# EAGLE design proyecto (EAGLE 9.6.2)
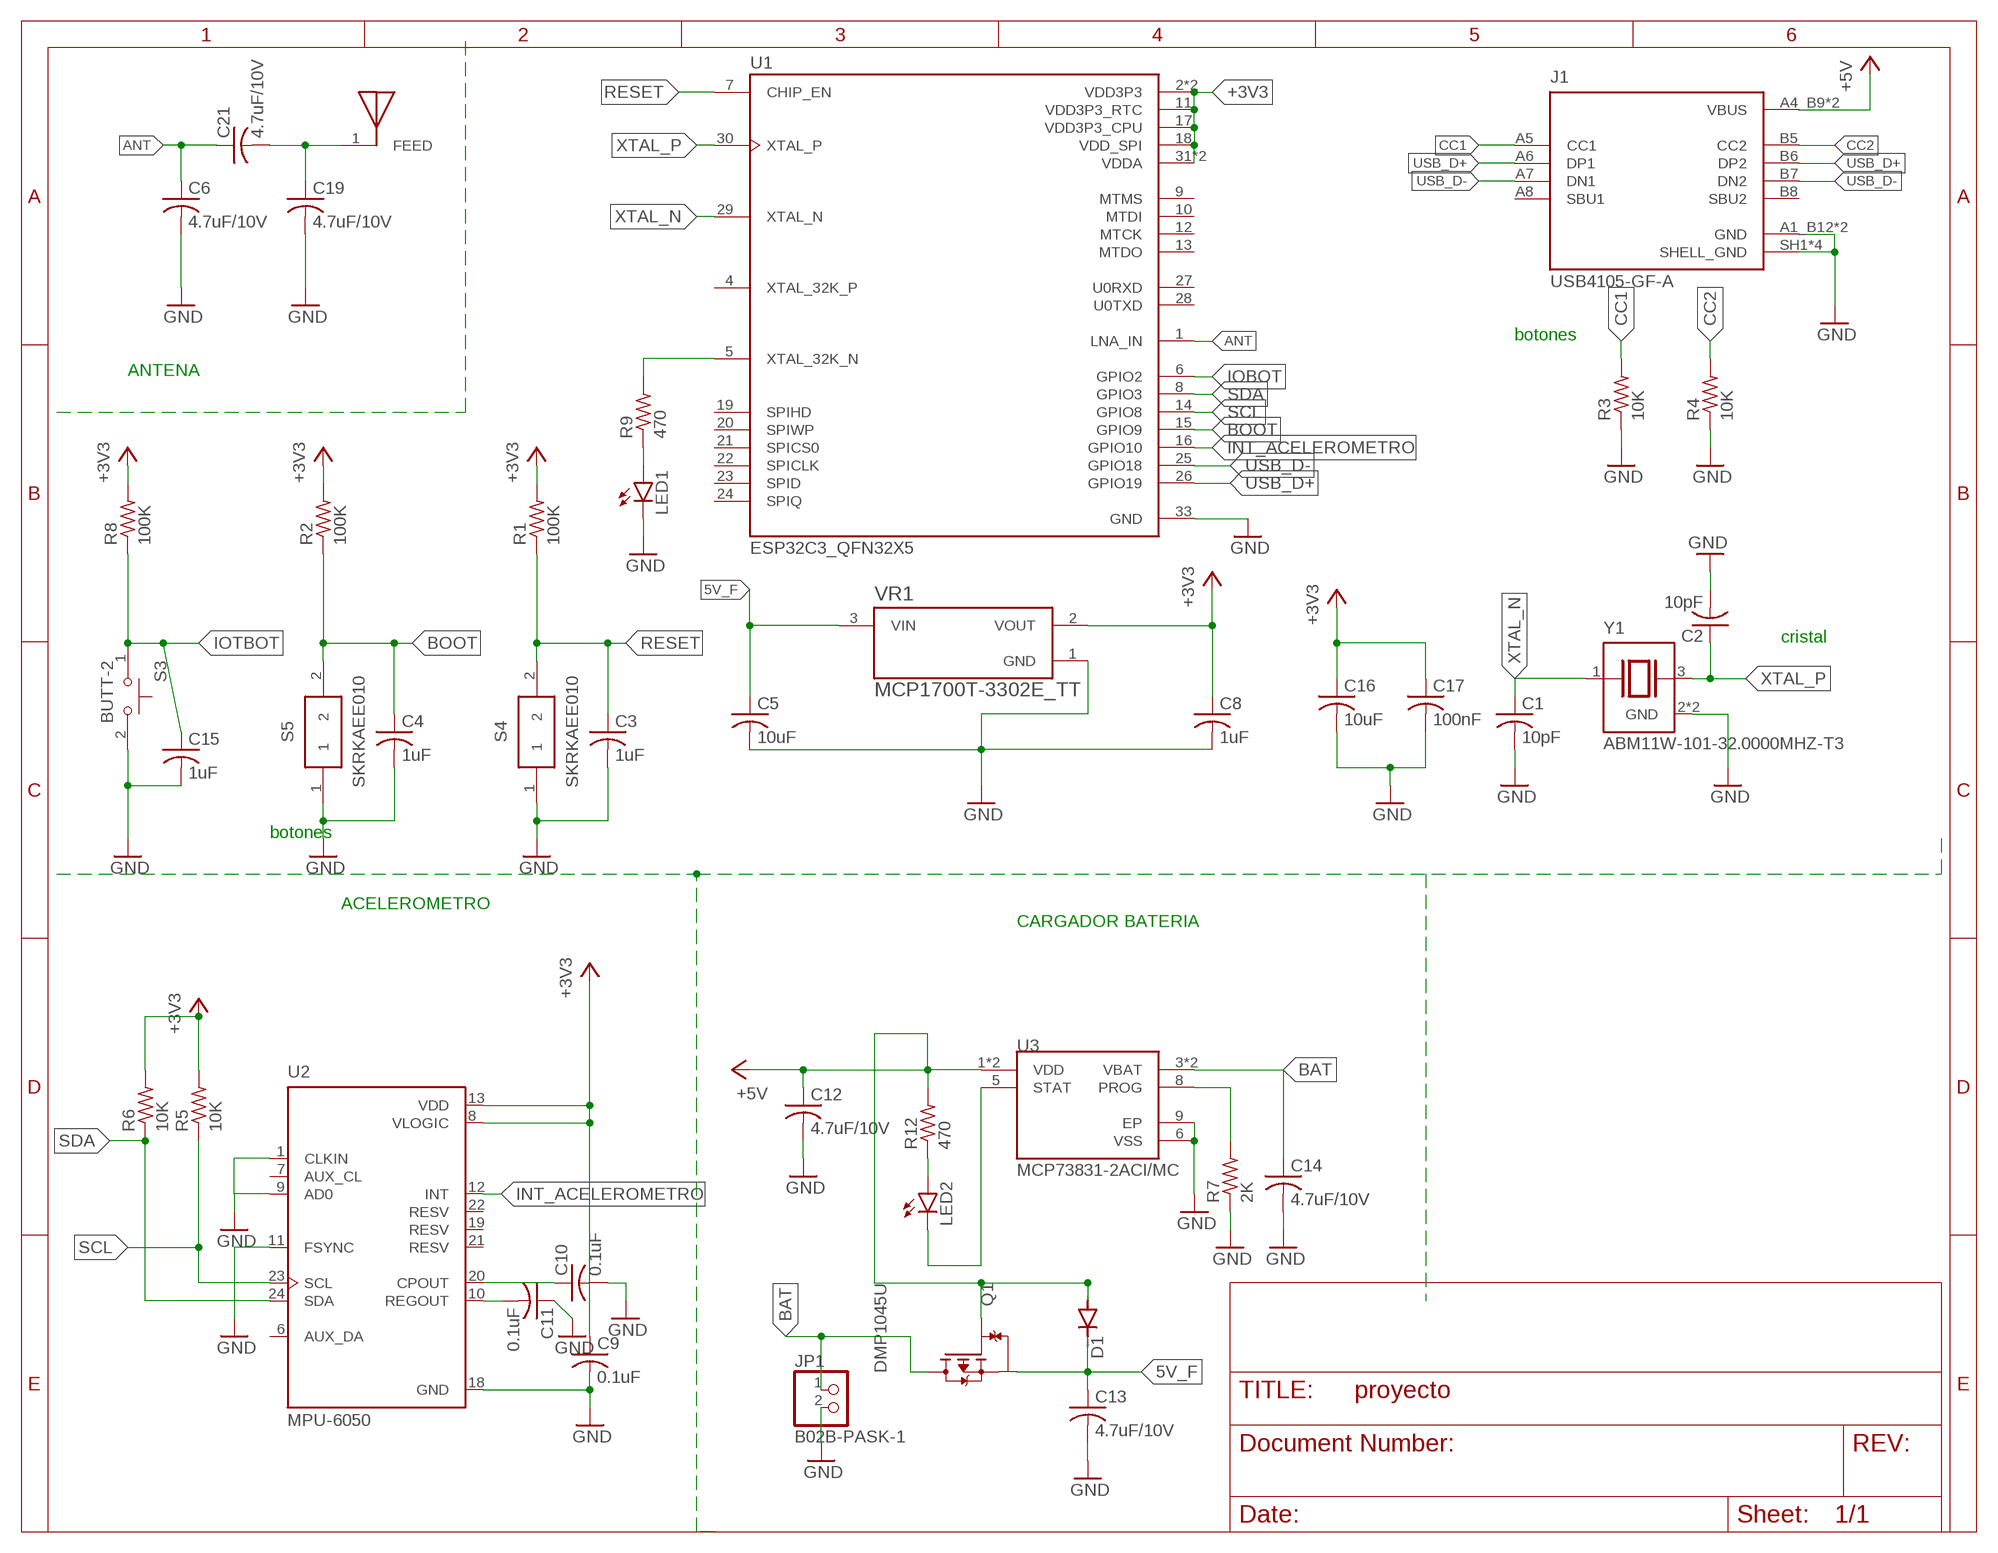
[diagram p0: schematic, sheet 1]

## Parts
C1  10pF  C-USC0603  [C0603]
C2  10pF  C-USC0603  [C0603]
C3  1uF  C-USC0603  [C0603]
C4  1uF  C-USC0603  [C0603]
C5  10uF  C-USC0603  [C0603]
C6  4.7uF/10V  C-USC0603  [C0603]
C8  1uF  C-USC0603  [C0603]
C9  0.1uF  C-USC0603  [C0603]
C10  0.1uF  C-USC0603  [C0603]
C11  0.1uF  C-USC0603  [C0603]
C12  4.7uF/10V  C-USC0603  [C0603]
C13  4.7uF/10V  C-USC0603  [C0603]
C14  4.7uF/10V  C-USC0603  [C0603]
C15  1uF  C-USC0603  [C0603]
C16  10uF  C-USC0603  [C0603]
C17  100nF  C-USC0603  [C0603]
C19  4.7uF/10V  C-USC0603  [C0603]
C21  4.7uF/10V  C-USC0603  [C0603]
D1  DIODE-DO214AA  [DO214AA]
J1  USB4105-GF-A  [GCT_USB4105-GF-A]
JP1  B02B-PASK-1  [B02B-PASK-1]
LED1  LEDSML0603  [SML0603]
LED2  LEDSML0603  [SML0603]
Q1  DMP1045U  [SOT91P240X110-3N]
R1  100K  R-US_R0603  [R0603]
R2  100K  R-US_R0603  [R0603]
R3  10K  R-US_R0603  [R0603]
R4  10K  R-US_R0603  [R0603]
R5  10K  R-US_R0603  [R0603]
R6  10K  R-US_R0603  [R0603]
R7  2K  R-US_R0603  [R0603]
R8  100K  R-US_R0603  [R0603]
R9  470  R-US_R0603  [R0603]
R12  470  R-US_R0603  [R0603]
S3  BUTT-2  [SW_BUTT-2]
S4  SKRKAEE010  [SKRK]
S5  SKRKAEE010  [SKRK]
U1  ESP32C3_QFN32X5  [QFN32_5X5MM]
U2  MPU-6050  [QFN50P400X400X95-24N]
U3  MCP73831-2ACI/MC  [SON50P200X300X100-9N]
U$1  RFANT5220110A0T  [ANTENA]
VR1  MCP1700T-3302E_TT  [SOT95P237X112-3N]
Y1  ABM11W-101-32.0000MHZ-T3  [XTAL_ABM11W-101-32.0000MHZ-T3]

## Nets
5V_F: C5.1 C13.1 D1.C Q1.2(S) VR1.3(VIN)
+3V3: C8.1 C9.1 C16.1 C17.1 R1.2 R2.2 R5.2 R6.2 R8.2 U1.2(VDD3P3) U1.3(VDD3P3) U1.11(VDD3P3_RTC) U1.17(VDD3P3_CPU) U1.18(VDD_SPI) U1.31(VDDA) U1.32(VDDA) U2.8(VLOGIC) U2.13(VDD) VR1.2(VOUT)
+5V: C12.1 D1.A J1.A4_B9(VBUS) J1.B4_A9(VBUS) Q1.1(G) R12.2 U3.1(VDD) U3.2(VDD)
+5V1: R9.2 U1.5(XTAL_32K_N)
ANT: C6.1 C21.1 U1.1(LNA_IN)
BAT: C14.1 JP1.1 Q1.3(D) U3.3(VBAT) U3.4(VBAT)
BOOT: C4.1 R2.1 S5.2 U1.15(GPIO9)
CC1: J1.A5(CC1) R3.2
CC2: J1.B5(CC2) R4.2
GND: C1.2 C2.2 C3.2 C4.2 C5.2 C6.2 C8.2 C9.2 C10.2 C11.1 C12.2 C13.2 C14.2 C15.2 C16.2 C17.2 C19.2 J1.A1_B12(GND) J1.B1_A12(GND) J1.SH1(SHELL_GND) J1.SH2(SHELL_GND) J1.SH3(SHELL_GND) J1.SH4(SHELL_GND) JP1.2 LED1.C R3.1 R4.1 R7.1 S3.2 S4.1 S5.1 U1.33(GND) U2.1(CLKIN) U2.9(AD0) U2.11(FSYNC) U2.18(GND) U3.6(VSS) U3.9(EP) VR1.1(GND) Y1.2(GND) Y1.4(GND)
INT_ACELEROMETRO: U1.16(GPIO10) U2.12(INT)
IOBOT: U1.6(GPIO2)
IOTBOT: C15.1 R8.1 S3.1
N$1: LED1.A R9.1
N$3: LED2.A R12.1
N$4: LED2.C U3.5(STAT)
N$5: R7.2 U3.8(PROG)
N$8: C11.2 U2.10(REGOUT)
N$10: C10.1 U2.20(CPOUT)
N$14: C19.1 C21.2 U$1.1(FEED)
RESET: C3.1 R1.1 S4.2 U1.7(CHIP_EN)
SCL: R5.1 U1.14(GPIO8) U2.23(SCL)
SDA: R6.1 U1.8(GPIO3) U2.24(SDA)
USB_D+: J1.A6(DP1) J1.B6(DP2) U1.26(GPIO19)
USB_D-: J1.A7(DN1) J1.B7(DN2) U1.25(GPIO18)
XTAL_N: C1.1 U1.29(XTAL_N) Y1.1
XTAL_P: C2.1 U1.30(XTAL_P) Y1.3
Unconnected: J1.A8(SBU1) J1.B8(SBU2) U1.4(XTAL_32K_P) U1.9(MTMS) U1.10(MTDI) U1.12(MTCK) U1.13(MTDO) U1.19(SPIHD) U1.20(SPIWP) U1.21(SPICS0) U1.22(SPICLK) U1.23(SPID) U1.24(SPIQ) U1.27(U0RXD) U1.28(U0TXD) U2.6(AUX_DA) U2.7(AUX_CL) U2.19(RESV) U2.21(RESV) U2.22(RESV)

## Notes on the sheet
- botones
- ANTENA
- cristal
- botones
- ACELEROMETRO
- CARGADOR BATERIA

## Library data of the parts
C1-C6 C8-C17 C19 C21 = rcl:C-US: CAPACITOR, American symbol; SPICEPREFIX: C
D1 = diode:DIODE-: DIODE
J1 = USB4105-GF-A:USB4105-GF-A: Check availability <https://pricing.snapeda.com/parts/USB4105-GF-A/GCT/view-part?ref=eda>; AVAILABILITY: In Stock; CHECK_PRICES: https://www.snapeda.com/parts/USB4105-GF-A/Global+Connector+Technology/view-part/?ref=eda; DESCRIPTION: USB-C (USB TYPE-C) USB 2.0 Receptacle Connector 24 (16+8 Dummy) Position Surface Mount, Right Angle; Through Hole; MF: GCT; MP: USB4105-GF-A; PACKAGE: None; PRICE: None; PURCHASE-URL: https://www.snapeda.com/api/url_track_click_mouser/?unipart_id=4423780&manufacturer=GCT&part_name=USB4105-GF-A&search_term=usb4105 gf a; SNAPEDA_LINK: https://www.snapeda.com/parts/USB4105-GF-A/Global+Connector+Technology/view-part/?ref=snap
JP1 = B02B-PASK-1:B02B-PASK-1: Connector JST PA series, 2 pin, 2mm pitch. Check availability <https://pricing.snapeda.com/parts/B02B-PASK-1/JST%20Sales/view-part?ref=eda>; AVAILABILITY: In Stock; CHECK_PRICES: https://www.snapeda.com/parts/B02B-PASK-1/JST+Sales+America+Inc./view-part/?ref=eda; DESCRIPTION: Connector Header Through Hole 2 position 0.079 (2.00mm); MF: JST Sales; MP: B02B-PASK-1; PACKAGE: None; PRICE: None; SNAPEDA_LINK: https://www.snapeda.com/parts/B02B-PASK-1/JST+Sales+America+Inc./view-part/?ref=snap
LED1 LED2 = led:LED: LED OSRAM: - CHIPLED LG R971, LG N971, LY N971, LG Q971, LY Q971, LO R971, LY R971 LH N974, LH R974 LS Q976, LO Q976, LY Q976 LO Q996 - Hyper CHIPLED LW Q18S LB Q993, LB Q99A, LB R99A - SideLED LS A670, LO A670, LY A670, LG A670, LP A670 LB A673, LV A673, LT A673, LW A673 LH A674 LY A675 LS A676, LA A676, LO A676, LY A676, LW A676 LS A679, LY A679, LG A679 - Hyper Micro SIDELED® LS Y876, LA Y876, LO Y876, LY Y876 LT Y87S - SmartLED LW L88C, LW L88S LB L89C, LB L89S, LG L890 LS L89K, LO L89K, LY L89K LS L896, LA L896, LO L896, LY L896 - TOPLED LS T670, LO T670, LY T670, LG T670, LP T670 LSG T670, LSP T670, LSY T670, LOP T670, LYG T670 LG T671, LOG T671, LSG T671 LB T673, LV T673, LT T673, LW T673 LH T674 LS T676, LA T676, LO T676, LY T676, LB T676, LH T676, LSB T676, LW T676 LB T67C, LV T67C, LT T67C, LS T67K, LO T67K, LY T67K, LW E67C LS E67B, LA E67B, LO E67B, LY E67B, LB E67C, LV E67C, LT E67C LW T67C LS T679, LY T679, LG T679 LS T770, LO T770, LY T770, LG T770, LP T770 LB T773, LV T773, LT T773, LW T773 LH T774 LS E675, LA E675, LY E675, LS T675 LS T776, LA T776, LO T776, LY T776, LB T776 LHGB T686 LT T68C, LB T68C - Hyper Mini TOPLED® LB M676 - Mini TOPLED Santana® LG M470 LS M47K, LO M47K, LY M47K Source: http://www.osram.convergy.de LUXEON: - LUMILED® LXK2-PW12-R00, LXK2-PW12-S00, LXK2-PW14-U00, LXK2-PW14-V00 LXK2-PM12-R00, LXK2-PM12-S00, LXK2-PM14-U00 LXK2-PE12-Q00, LXK2-PE12-R00, LXK2-PE12-S00, LXK2-PE14-T00, LXK2-PE14-U00 LXK2-PB12-K00, LXK2-PB12-L00, LXK2-PB12-M00, LXK2-PB14-N00, LXK2-PB14-P00, LXK2-PB14-Q00 LXK2-PR12-L00, LXK2-PR12-M00, LXK2-PR14-Q00, LXK2-PR14-R00 LXK2-PD12-Q00, LXK2-PD12-R00, LXK2-PD12-S00 LXK2-PH12-R00, LXK2-PH12-S00 LXK2-PL12-P00, LXK2-PL12-Q00, LXK2-PL12-R00 Source: www.luxeon.com KINGBRIGHT: KA-3528ASYC Source: www.kingbright.com
Q1 = DMP1045U:DMP1045U: P-Channel 12V 4A (Ta) 800mW (Ta) Surface Mount SOT-23 Check availability <https://pricing.snapeda.com/parts/DMP1045U/Diodes%20Inc./view-part?ref=eda>; AVAILABILITY: In Stock; CHECK_PRICES: https://www.snapeda.com/parts/DMP1045U/Diodes+Inc./view-part/?ref=eda; DESCRIPTION: P-Channel 12 V 2.6A (Ta) 530mW Surface Mount X2-WLB0808-4 (Type C); MF: Diodes Inc.; MP: DMP1045U; PACKAGE: SOT-23 Diodes Inc.; PRICE: None; SNAPEDA_LINK: https://www.snapeda.com/parts/DMP1045U/Diodes+Inc./view-part/?ref=snap
R1-R9 R12 = rcl:R-US_: RESISTOR, American symbol; SPICEPREFIX: R
S3 = BUTT-2:BUTT-2: Tactile Switches MINI PUSH BUTTON SWITCH 2-PIN QTY. 4 Check availability <https://pricing.snapeda.com/parts/BUTT-2/Gravitech/view-part?ref=eda>; AVAILABILITY: In Stock; CHECK_PRICES: https://www.snapeda.com/parts/BUTT-2/Gravitech/view-part/?ref=eda; DESCRIPTION: Tactile Switches MINI PUSH BUTTON SWITCH 2-PIN QTY. 4; MF: Gravitech; MP: BUTT-2; PACKAGE: None; PRICE: None; SNAPEDA_LINK: https://www.snapeda.com/parts/BUTT-2/Gravitech/view-part/?ref=snap
S4 S5 = SKRKAEE010:SKRKAEE010: Tactile Switches 3.9x2.9x2.0mm 160gf Packaging Temp 60oC <https://componentsearchengine.com/Images/1/SKRKAEE010.jpg> Source: Datasheet <http://www.mouser.com/ds/2/15/SKRK-1110686.pdf> Check availability <https://pricing.snapeda.com/parts/SKRKAEE010/ALPS/view-part?ref=eda>; AVAILABILITY: In Stock; CHECK_PRICES: https://www.snapeda.com/parts/SKRKAEE010/ALPS/view-part/?ref=eda; DESCRIPTION: Switch Tactile N.O. SPST Round Button Gull Wing 0.05A 12VDC 1.57N SMD T/R; MF: ALPS; MP: SKRKAEE010; PACKAGE: None; PRICE: None; SNAPEDA_LINK: https://www.snapeda.com/parts/SKRKAEE010/ALPS/view-part/?ref=snap
U1 = ESP32C3:ESP32C3: Check availability <https://pricing.snapeda.com/parts/ESP32-C3/Espressif%20Systems/view-part?ref=eda>; AVAILABILITY: In Stock; CHECK_PRICES: https://www.snapeda.com/parts/ESP32-C3/Espressif+Systems/view-part/?ref=eda; DESCRIPTION: WiFi Modules (802.11) (Engineering Samples Only) SMD IC ESP32-C3, RISC-V single-core MCU, 2.4G Wi-Fi & BLE 5.0 combo, QFN 32-pin, 5*5 mm, 40 ~ 105C; MF: Espressif Systems; MP: ESP32-C3; PACKAGE: VFQFN-32 Espressif Systems; PRICE: None; PURCHASE-URL: https://www.snapeda.com/api/url_track_click_mouser/?unipart_id=5833677&manufacturer=Espressif Systems&part_name=ESP32-C3&search_term=esp32 c3; SNAPEDA_LINK: https://www.snapeda.com/parts/ESP32-C3/Espressif+Systems/view-part/?ref=snap
U2 = MPU-6050:MPU-6050: MPU-6050 Six-Axis (Gyro + Accelerometer) MEMS MotionTracking™ Devices Check availability <https://pricing.snapeda.com/parts/MPU-6050/TDK%20InvenSense/view-part?ref=eda>; AVAILABILITY: In Stock; CHECK_PRICES: https://www.snapeda.com/parts/MPU-6050/TDK+InvenSense/view-part/?ref=eda; DESCRIPTION: MPU-6050 series Accelerometer, Gyroscope, 3 Axis Sensor Evaluation Board; MF: TDK InvenSense; MP: MPU-6050; PACKAGE: QFN-24 InvenSense; PRICE: None; PURCHASE-URL: https://www.snapeda.com/api/url_track_click_mouser/?unipart_id=43944&manufacturer=TDK InvenSense&part_name=MPU-6050&search_term=mpu6050; SNAPEDA_LINK: https://www.snapeda.com/parts/MPU-6050/TDK+InvenSense/view-part/?ref=snap
U3 = MCP73831-2ACI_MC:MCP73831-2ACI/MC: MCP73831 Series Single-Cell Li-Ion/Li-Polymer Battery Charge Controller - DFN-8 Check availability <https://pricing.snapeda.com/parts/MCP73831-2ACI/MC/Microchip/view-part?ref=eda>; AVAILABILITY: In Stock; CHECK_PRICES: https://www.snapeda.com/parts/MCP73831-2ACI/MC/Microchip/view-part/?ref=eda; DESCRIPTION: Charge Controller Li-Ion/Li-Pol 15mA to 500mA 4.2V 8-Pin DFN EP | Microchip Technology Inc. MCP73831-2ACI/MC; MF: Microchip; MP: MCP73831-2ACI/MC; PACKAGE: VFDFN-8 Microchip; PRICE: None; SNAPEDA_LINK: https://www.snapeda.com/parts/MCP73831-2ACI/MC/Microchip/view-part/?ref=snap
U$1 = untitled:RFANT5220110A0T
VR1 = MCP1700T-3302E_TT:MCP1700T-3302E_TT: Check availability <https://pricing.snapeda.com/parts/MCP1700T-3302E/TT/Microchip/view-part?ref=eda>; AVAILABILITY: In Stock; CHECK_PRICES: https://www.snapeda.com/parts/MCP1700T-3302E/TT/Microchip/view-part/?ref=eda; DESCRIPTION: Pwr Sply Func,Voltage Regulator,LDO,SOT-23,PD 369.6mW,VO 3.3V,Regline +/-0.75%/V | Microchip Technology Inc. MCP1700T-3302E/TT; MF: Microchip; MP: MCP1700T-3302E/TT; PACKAGE: SOT-23 Microchip; PRICE: None; PURCHASE-URL: https://www.snapeda.com/api/url_track_click_mouser/?unipart_id=8101&manufacturer=Microchip&part_name=MCP1700T-3302E/TT&search_term=mcp1700; SNAPEDA_LINK: https://www.snapeda.com/parts/MCP1700T-3302E/TT/Microchip/view-part/?ref=snap
Y1 = ABM11W-101-32.0000MHZ-T3:ABM11W-101-32.0000MHZ-T3: Check availability <https://pricing.snapeda.com/parts/ABM11W-101-32.0000MHZ-T3/Abracon%20LLC/view-part?ref=eda>; AVAILABILITY: In Stock; CHECK_PRICES: https://www.snapeda.com/parts/ABM11W-101-32.0000MHZ-T3/Abracon+LLC/view-part/?ref=eda; DESCRIPTION: IoT OPTIMIZED LOW PROFILE QUARTZ CRYSTAL; MF: Abracon LLC; MP: ABM11W-101-32.0000MHZ-T3; PACKAGE: SMD-4 Abracon LLC; PRICE: None; SNAPEDA_LINK: https://www.snapeda.com/parts/ABM11W-101-32.0000MHZ-T3/Abracon+LLC/view-part/?ref=snap

## Board
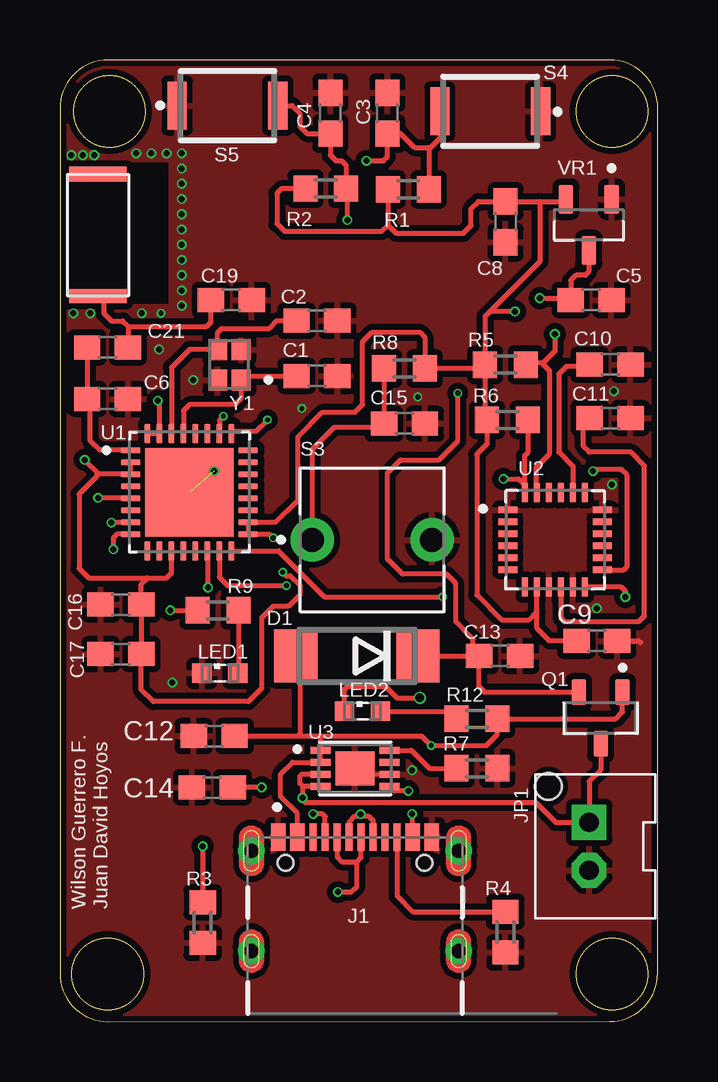
[diagram p1: board, top side]
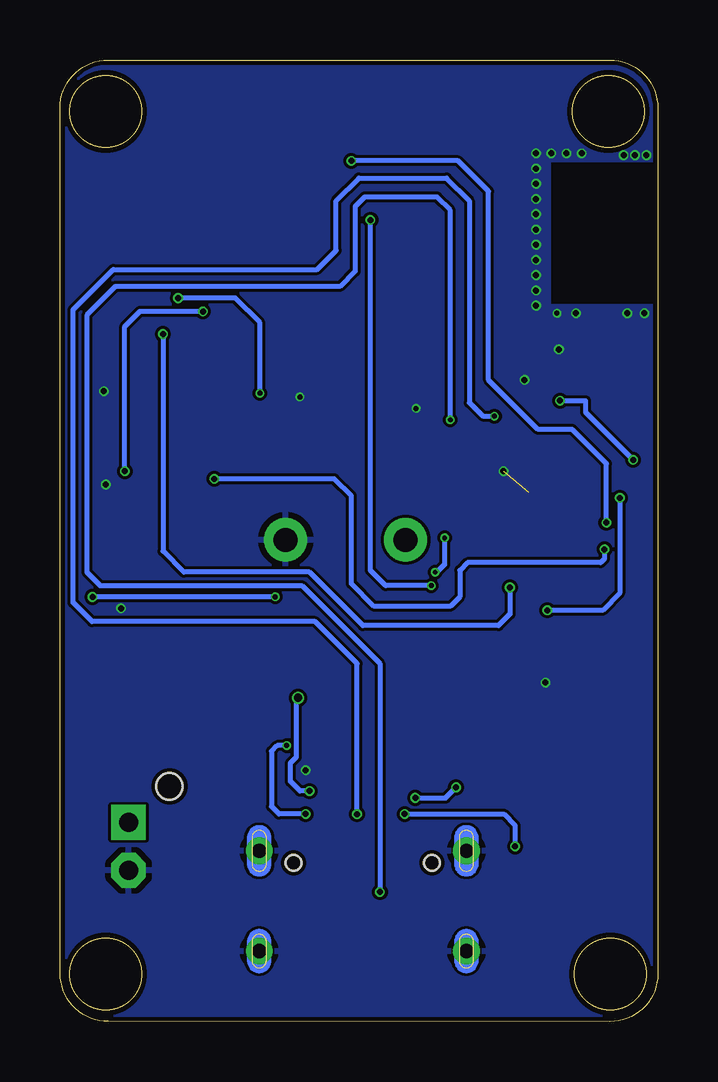
[diagram p2: board, bottom side, seen from below]

Size 24.93 x 40.09 mm. Coordinates in mm from the lower left corner, seen from the top.
Outline: 2,0 22.92,0.01 arc90 24.92,2.02 24.93,38.09 arc90 22.93,40.09 2,40.09 arc90 0,38.09 0,2 arc90 2,0
Outline: circle at 2.06,37.95 radius 1.5
Outline: circle at 23.02,1.99 radius 1.5
Outline: circle at 23.02,37.95 radius 1.5
Outline: circle at 1.98,1.99 radius 1.5
Copper layers (1*16): Top 0.035mm / dielectric 1.6mm / Bottom 0.035mm
Design rules "jlcpcb-2layers": minimum track width 5mil, minimum drill 0.3mm, track to track 5mil, track to pad 5mil, pad to pad 5mil, via to via 5mil, smd to smd 5mil, copper to edge 0.2mm, drill to drill 6mil, minimum pad ring 10mil, minimum via ring 3mil, stop-mask expansion 4mil, vias tented up to drill 0mil, thermal gap 10mil

### Footprints (pad centres in the part's own frame; a part is rotated, then mirrored left to right if it is on the bottom)
C0603 = smd 1.1 x 1: 1 -0.85,0; 2 0.85,0
DO214AA = smd 1.8 x 2.2: A 2.55,0; C -2.55,0
GCT_USB4105-GF-A = smd 0.6 x 1.15: A1_B12 -3.2,4.755; A4_B9 -2.4,4.755; B1_A12 3.2,4.755; B4_A9 2.4,4.755 | smd 0.3 x 1.15: A5 -1.25,4.755; A6 -0.25,4.755; A7 0.25,4.755; A8 1.25,4.755; B5 1.75,4.755; B6 0.75,4.755; B7 -0.75,4.755; B8 -1.75,4.755 | drill 0.6 pad 1: SH1 -4.32,4.18; SH2 4.32,4.18; SH3 -4.32,0; SH4 4.32,0 | hole 0.65: 2.89,3.68; -2.89,3.68
B02B-PASK-1 = drill 0.8 square: 1 -1,0 | drill 0.8 octagon: 2 1,0 | hole 1.1: -2.5,-1.7
SML0603 = smd 0.8 x 0.8: A 0.75,0; C -0.75,0
SOT91P240X110-3N = smd 1.09 x 0.61: 1 -1.07,0.915; 2 -1.07,-0.915; 3 1.07,0
R0603 = smd 1 x 1.1: 1 -0.85,0; 2 0.85,0
SW_BUTT-2 = drill 1: 1 -2.5,0; 2 2.5,0
SKRK = smd 0.8 x 2: 1 -2.1,0; 2 2.1,0
QFN32_5X5MM = smd 0.81 x 0.27: 1 -2.45,1.75; 2 -2.45,1.25; 3 -2.45,0.75; 4 -2.45,0.25; 5 -2.45,-0.25; 6 -2.45,-0.75; 7 -2.45,-1.25; 8 -2.45,-1.75; 17 2.45,-1.75; 18 2.45,-1.25; 19 2.45,-0.75; 20 2.45,-0.25; 21 2.45,0.25; 22 2.45,0.75; 23 2.45,1.25; 24 2.45,1.75 | smd 0.27 x 0.81: 9 -1.75,-2.45; 10 -1.25,-2.45; 11 -0.75,-2.45; 12 -0.25,-2.45; 13 0.25,-2.45; 14 0.75,-2.45; 15 1.25,-2.45; 16 1.75,-2.45; 25 1.75,2.45; 26 1.25,2.45; 27 0.75,2.45; 28 0.25,2.45; 29 -0.25,2.45; 30 -0.75,2.45; 31 -1.25,2.45; 32 -1.75,2.45 | smd 3.7 x 3.7: 33 0,0
QFN50P400X400X95-24N = smd 0.79 x 0.26: 1 -1.97,1.25; 2 -1.97,0.75; 3 -1.97,0.25; 4 -1.97,-0.25; 5 -1.97,-0.75; 6 -1.97,-1.25; 13 1.97,-1.25; 14 1.97,-0.75; 15 1.97,-0.25; 16 1.97,0.25; 17 1.97,0.75; 18 1.97,1.25 | smd 0.26 x 0.79: 7 -1.25,-1.97; 8 -0.75,-1.97; 9 -0.25,-1.97; 10 0.25,-1.97; 11 0.75,-1.97; 12 1.25,-1.97; 19 1.25,1.97; 20 0.75,1.97; 21 0.25,1.97; 22 -0.25,1.97; 23 -0.75,1.97; 24 -1.25,1.97
SON50P200X300X100-9N = smd 0.84 x 0.27: 1 -1.435,0.75; 2 -1.435,0.25; 3 -1.435,-0.25; 4 -1.435,-0.75; 5 1.435,-0.75; 6 1.435,-0.25; 7 1.435,0.25; 8 1.435,0.75 | smd 1.625 x 1.425: 9 0,0
ANTENA = smd 2.4 x 0.6: 1 0,0 | smd 2.4 x 0.635: 2 0,5.08
SOT95P237X112-3N = smd 1.22 x 0.62: 1 -1.065,0.95; 2 -1.065,-0.95; 3 1.065,0
XTAL_ABM11W-101-32.0000MHZ-T3 = smd 0.775 x 0.875: 1 -0.487,0.637; 2 -0.487,-0.637; 3 0.487,-0.637; 4 0.487,0.637

### Placement (x,y rotation side)
C1  10.72,26.91 0 top
C2  10.72,29.22 0 top
C3  13.65,37.87 90 top
C4  11.27,37.87 90 top
C5  22.15,30.09 0 top
C6  1.98,25.96 0 top
C8  18.57,33.34 270 top
C9  22.38,15.88 0 top
C10  22.94,27.39 0 top
C11  22.94,25.17 180 top
C12  6.43,11.91 180 top
C13  18.34,15.25 0 top
C14  6.35,9.77 180 top
C15  14.37,24.93 0 top
C16  2.54,17.39 180 top
C17  2.54,15.33 180 top
C19  7.14,30.09 0 top
C21  1.98,28.11 0 top
D1  12.38,15.25 180 top
J1  12.3,2.94 0 top
JP1  22.07,7.31 270 top
LED1  6.67,14.53 0 top
LED2  12.62,12.94 0 top
Q1  22.54,12.66 270 top
R1  14.53,34.69 180 top
R2  11.08,34.72 180 top
R3  5.95,4.13 90 top
R4  18.57,3.74 90 top
R5  18.57,27.39 180 top
R6  18.65,25.09 180 top
R7  17.38,10.56 180 top
R8  14.37,27.23 0 top
R9  6.59,17.15 180 top
R12  17.38,12.63 0 top
S3  13.02,20.09 0 top
S4  17.94,37.95 180 top
S5  6.99,38.19 0 top
U1  5.4,22.07 0 top
U2  20.64,20.09 0 top
U3  12.3,10.56 0 top
U$1  1.59,30.25 0 top
VR1  22.05,33.22 270 top
Y1  7.06,27.39 180 top

### Tracks (layer width: path | path; a pad name or v marks a point on that pad's centre or on a via)
5V_F  (via drill 0.2, 0.25)
  Top 0.203: VR1.3 22.05,31.26 21.91,31.12 21.51,31.12 21.3,30.91 21.3,30.17 | 21.3,30.17 C5.1 | D1.C C13.1 | Q1.2 17.71,13.73 17.46,13.98 17.46,15.22 C13.1 | C13.1 17.22,15.51 17.22,15.96 16.51,16.68 16.51,18.26 16.11,18.66 14.29,18.66 13.65,19.29 13.65,22.87 14.21,23.42 15.8,23.42 16.59,24.22 v16.59,26.2 | v20,30.17 21.29,30.17 21.3,30.17
  Bottom 0.203: v16.59,26.2 16.59,29.14 17.62,30.17 v20,30.17
+3V3  (via drill 0.2, 0.25)
  Top 0.203: 20,34.19 C8.1 17.44,34.19 17.14,33.9 17.14,33.19 16.83,32.87 14.02,32.87 13.68,33.21 | 20,34.19 21.01,34.19 VR1.2 | R5.2 17.57,27.23 R8.2 15.22,28.53 15,28.74 13.02,28.74 12.62,28.34 12.62,25.72 12.3,25.41 10.95,25.41 9.92,24.37 9.92,21.76 8.99,20.82 U1.18 U1.17 8.73,20.32 v8.89,20.17 | R5.2 17.72,25.17 R6.2 17.8,24.08 17.38,23.66 17.38,17.79 18.41,16.75 19.57,16.75 19.89,17.07 | U1.32 4.13,24.52 | 4.13,24.52 U1.31 | U1.3 U1.2 | U1.3 2.91,22.79 | U1.3 1.63,22.82 | 1.63,22.82 1.55,22.82 1.55,22.75 0.79,21.99 0.79,18.9 1.19,18.5 3.65,18.5 | v1.03,23.42 1.63,22.82 | v4.08,25.88 4.13,25.84 4.13,24.52 | 3.65,18.5 3.39,18.24 C16.1 C17.1 3.39,13.84 3.89,13.34 7.86,13.34 8.41,13.9 8.41,16.83 8.89,17.31 9.53,17.31 10,17.79 10,18.2 9.61,18.59 9.44,18.59 v9.29,18.74 | 3.65,18.5 4.45,18.5 4.65,18.7 U1.11 | C9.1 20.4,15.88 19.89,16.39 19.89,17.07 | 19.89,17.07 U2.8 | R2.2 9.24,34.73 9.05,34.53 9.05,33.26 9.37,32.95 13.41,32.95 13.68,33.21 | R1.2 13.68,33.21 | 20,34.19 20,31.68 17.93,29.61 | 17.93,29.61 17.72,29.4 R5.2 | U2.13 23.52,18.84 23.65,18.98 23.65,22.79 23.42,23.03 22.23,23.03 v22.23,22.95 | v18.97,29.61 17.93,29.61
  Bottom 0.203: v1.03,23.42 3.02,25.41 3.02,25.88 v4.08,25.88 | v22.23,22.95 22.23,28.98 21.59,29.61 v18.97,29.61 | v8.89,20.17 8.89,19.06 9.21,18.74 v9.29,18.74
+5V  (via drill 0.2, 0.25)
  Top 0.203: J1.A4_B9 9.9,8.68 9.21,9.37 9.21,10.33 9.7,10.81 U3.2 U3.1 10.87,11.91 | C12.1 9.92,11.91 | 9.92,11.91 10.87,11.91 | Q1.1 23.46,12.91 23.18,12.63 R12.2 18.23,11.97 17.78,11.52 v15.48,11.52 15.08,11.91 10.87,11.91 | J1.B4_A9 14.7,8.64 v14.68,8.66 | D1.A 10,15.08 10,11.99 9.92,11.91
  Bottom 0.203: v15.48,11.52 15.88,11.52 16.11,11.28 16.11,8.98 15.8,8.66 v14.68,8.66
+5V1  (via drill 0.25)
  Top 0.203: U1.5 1.6,21.82 v1.59,21.83 | v4.6,17.15 R9.2
  Bottom 0.203: v4.6,17.15 2.3,17.15 1.59,17.87 v1.59,21.83
ANT
  Top 0.203: C21.1 C6.1 1.27,25.83 1.27,24.22 1.66,23.82 U1.1
BAT  (via drill 0.25)
  Top 0.203: Q1.3 22.54,10.48 22.07,10.01 JP1.1 20.67,8.31 19.84,9.13 10.24,9.13 10.08,9.29 v10.12,9.33 10.12,9.81 | U3.4 10.12,9.81 | 10.12,9.81 10,9.93 10,10.25 10.08,10.33 10.86,10.33 U3.3 | v8.41,9.77 C14.1
  Bottom 0.203: v10.12,9.33 8.85,9.33 v8.41,9.77
BOOT  (via drill 0.2, 0.25)
  Top 0.203: S5.2 9.68,38.19 10,37.87 10,37.31 10.3,37.02 C4.1 11.27,36.12 11.51,35.88 11.75,35.88 11.93,35.7 R2.1 11.99,34.67 v11.99,33.42 | U1.15 6.65,18.52 6.99,18.18 v9.45,18.18
  Bottom 0.203: v9.45,18.18 11.35,18.18 11.99,18.82 v11.99,33.42
CC1  (via drill 0.25)
  Top 0.203: v5.95,7.31 R3.2 | J1.A5 11.05,8.56 10.96,8.65 v10.56,8.65
  Bottom 0.203: v10.56,8.65 6.43,8.65 5.95,8.18 v5.95,7.31
CC2
  Top 0.203: J1.B5 14.05,5.24 14.71,4.59 R4.2
GND  (via drill 0.2, 0.25)  (1 unrouted)
  Top 0.152: U3.6 12.55,10.31 U3.9
  Top 0.203: v5.56,26.75 v5.56,26.76 | C9.2 24.13,15.88 24.21,15.8
  other vias: 0.48,36.12 0.95,36.12 1.43,36.12 3.17,36.2 3.81,36.2 4.45,36.2 5.08,36.2 5.08,35.57 5.08,34.93 5.08,34.3 5.08,33.66 5.08,33.03 5.08,32.39 5.08,31.76 5.08,30.49 5.08,29.85 4.21,29.53 3.41,29.53 1.27,29.53 0.56,29.53 5.08,31.12 4.13,28.02 23.02,22.39 10.08,25.57 14.92,26.04 23.1,26.28 22.38,17.23 14.68,10.48 4.68,14.14 6.43,22.95
  pour Top (isolate 0.254): -1.51,-1.26 -1.88,29.85 4.6,29.85 4.6,35.88 -1.51,35.88 -1.51,42.15 26.51,42.15 26.51,-1.26
  pour Bottom: -3.02,42.95 28.5,42.95 28.5,-2.85 -2.94,-2.85 -3.02,9.13 -3.02,29.85 4.52,29.85 4.52,35.88 -3.02,35.88
INT_ACELEROMETRO  (via drill 0.2, 0.25)
  Top 0.203: U1.16 9.12,19.62 11.03,17.71 v15.95,17.71 | v23.57,17.71 23.57,17.95 23.4,18.12 U2.12
  Bottom 0.203: v15.95,17.71 v23.57,17.71
IOTBOT
  Top 0.203: R8.1 C15.1 13.36,24.77 11.43,24.77 10.52,23.86 S3.1
N$1
  Top 0.203: R9.1 7.44,14.55 LED1.A
N$3
  Top 0.203: LED2.A 16.22,12.94 R12.1
N$4  (via drill 0.25, 0.35)
  Top 0.203: LED2.C 11.87,13.86 11.99,13.98 13.57,13.98 14.05,13.5 v15,13.5 | v14.52,9.61 13.94,9.61 U3.5
  Bottom 0.203: v15,13.5 15.07,13.43 15.07,11.03 15.32,10.78 15.32,10.01 14.92,9.61 v14.52,9.61
N$5
  Top 0.203: U3.8 14.65,11.31 15.4,10.56 R7.2
N$8
  Top 0.203: U2.10 20.89,16.82 21.03,16.68 24.13,16.68 24.37,16.91 24.37,23.18 23.81,23.74 22.07,23.74 21.83,23.98 21.83,24.91 C11.2
N$10
  Top 0.203: C10.1 22.01,27.31 21.11,27.31 20.8,26.99 20.8,23.74 21.39,23.15 U2.20
N$14
  Top 0.203: 6.13,30.25 C19.1 6.29,29.16 6.11,28.98 2.85,28.98 2.83,28.99 | U$1.1 1.83,30.01 1.83,29.53 2.15,29.21 2.62,29.21 2.83,28.99 | 2.83,28.99 C21.2
RESET  (via drill 0.25)
  Top 0.203: S4.2 15.84,36.84 15.38,36.37 | 15.38,36.37 15.38,36.44 14.79,36.44 14.21,37.02 C3.1 13.65,36.04 13.49,35.88 v12.78,35.88 | 15.38,36.37 R1.1 | U1.7 2.93,20.8 v2.14,20.8
  Bottom 0.203: v2.14,20.8 2.14,23.26 3.57,24.69 5,24.69 7.06,26.76 7.06,34.61 8.33,35.88 v12.78,35.88
SCL  (via drill 0.25)
  Top 0.203: R5.1 19.5,27.47 20.08,27.47 20.12,27.43 | 20.12,27.43 20.4,27.15 20.4,23.66 19.84,23.1 19.84,22.1 U2.23 | v20.64,28.66 20.64,27.95 20.12,27.43 | U1.14 6.15,18.12 v6.17,18.1
  Bottom 0.203: v6.17,18.1 6.17,16.99 6.64,16.52 12.3,16.52 14.53,18.74 19.76,18.74 20.64,19.61 v20.64,28.66
SDA  (via drill 0.25)
  Top 0.203: R6.1 19.5,23.72 19.37,23.58 19.37,22.39 | 19.37,22.39 19.37,22.08 U2.24 | U1.8 2.38,20.32 2.22,20.17 v2.22,19.69 | v18.49,22.63 19.13,22.63 19.37,22.39
  Bottom 0.203: v2.22,19.69 2.22,19.29 2.38,19.14 7.94,19.14 8.26,18.82 8.26,17.71 8.65,17.31 11.83,17.31 12.78,18.26 12.78,21.91 13.49,22.63 v18.49,22.63
USB_D+  (via drill 0.2, 0.25)
  Top 0.203: J1.A6 12.06,7.71 12.06,8.34 12.3,8.58 12.54,8.58 | 12.54,8.58 12.86,8.58 13.05,8.38 J1.B6 | 12.54,8.58 v12.54,8.65 | v6.81,25.24 6.65,25.08 U1.26
  Bottom 0.203: v12.54,8.65 12.54,14.93 14.29,16.68 23.59,16.68 24.38,17.47 24.38,29.68 22.7,31.36 14.21,31.36 13.41,32.15 13.41,34.22 12.46,35.17 8.81,35.17 7.86,34.22 7.86,25.8 7.3,25.25 v6.82,25.25 v6.81,25.24
USB_D-  (via drill 0.2, 0.25)
  Top 0.203: J1.B7 11.55,6.87 11.75,6.67 12.38,6.67 | 12.38,6.67 12.55,6.84 J1.A7 | U1.25 7.24,24.61 8.18,24.61 v8.65,25.09 | v11.59,5.4 12.14,5.4 12.38,5.64 12.38,6.67
  Bottom 0.203: v8.65,25.09 8.65,33.82 9.21,34.38 12.22,34.38 12.62,33.98 12.62,31.28 13.26,30.65 22.62,30.65 23.81,29.45 23.81,18.74 23.26,18.18 14.84,18.18 11.59,14.93 v11.59,5.4
XTAL_N
  Top 0.203: C1.1 7.71,26.91 Y1.1 7.55,25.97 7.3,25.72 5.4,25.72 5.15,25.47 U1.29
XTAL_P
  Top 0.203: C2.1 9.05,29.22 8.73,28.9 6.75,28.9 6.58,28.73 Y1.3 5.4,28.03 4.65,27.28 U1.30

### Text on the board
tNames: Wilson Guerrero F. / Juan David Hoyos